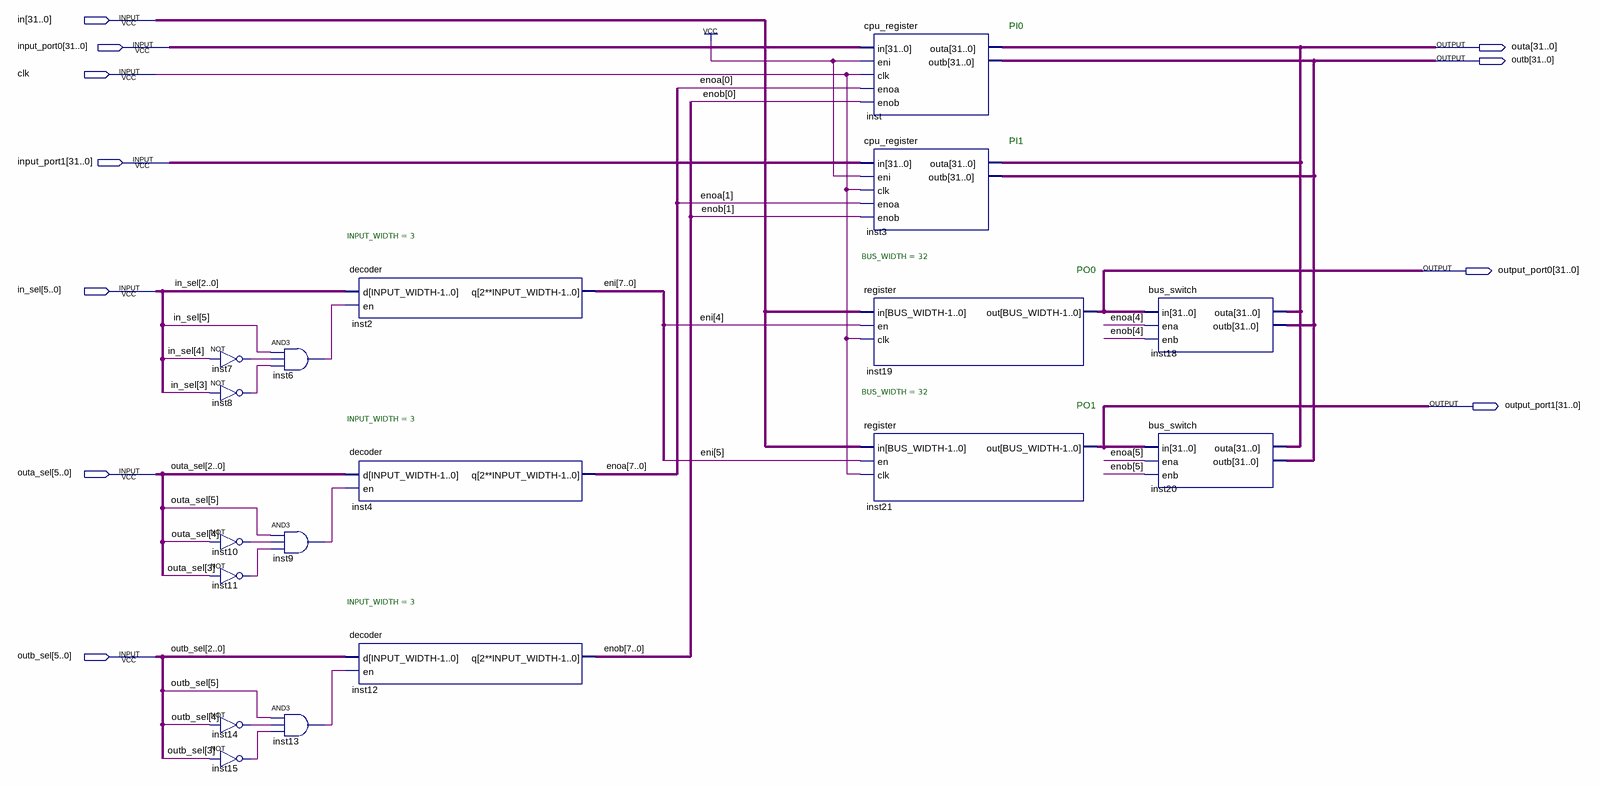
[diagram p0: schematic sheet]
// Quartus schematic port_register_bank.bdf as structural Verilog: 18 symbols, 11 pins
module port_register_bank (
  input  [31:0] in,
  input  [31:0] input_port0,
  input  clk,
  input  [31:0] input_port1,
  input  [5:0] in_sel,
  input  [5:0] outa_sel,
  input  [5:0] outb_sel,
  output [31:0] outa,
  output [31:0] outb,
  output [31:0] output_port0,
  output [31:0] output_port1
);

  wire inst6_out, inst7_out, inst8_out, inst9_out, inst10_out, inst11_out, inst13_out, inst14_out, inst15_out;
  wire [7:0] eni, enoa, enob;

  not inst7 (inst7_out, in_sel[4]);
  not inst8 (inst8_out, in_sel[3]);
  not inst10 (inst10_out, outa_sel[4]);
  not inst11 (inst11_out, outa_sel[3]);
  not inst14 (inst14_out, outb_sel[4]);
  not inst15 (inst15_out, outb_sel[3]);
  and inst6 (inst6_out, in_sel[5], inst7_out, inst8_out);
  and inst9 (inst9_out, outa_sel[5], inst10_out, inst11_out);
  and inst13 (inst13_out, outb_sel[5], inst14_out, inst15_out);
  decoder #(.INPUT_WIDTH(3)) inst2 (.d(in_sel[2:0]), .en(inst6_out), .q(eni));
  decoder #(.INPUT_WIDTH(3)) inst4 (.d(outa_sel[2:0]), .en(inst9_out), .q(enoa));
  decoder #(.INPUT_WIDTH(3)) inst12 (.d(outb_sel[2:0]), .en(inst13_out), .q(enob));
  cpu_register inst (.in(input_port0), .eni(1'b1), .clk(clk), .enoa(enoa[0]), .enob(enob[0]), .outa(outa), .outb(outb));
  cpu_register inst3 (
    .in(input_port1), .eni(1'b1), .clk(clk), .enoa(enoa[1]), .enob(enob[1]), .outa(outa), .outb(outb));
  register #(.BUS_WIDTH(32)) inst19 (.in(in), .en(eni[4]), .clk(clk), .out(output_port0));
  register #(.BUS_WIDTH(32)) inst21 (.in(in), .en(eni[5]), .clk(clk), .out(output_port1));
  bus_switch inst18 (.in(output_port0), .ena(enoa[4]), .enb(enob[4]), .outa(outa), .outb(outb));
  bus_switch inst20 (.in(output_port1), .ena(enoa[5]), .enb(enob[5]), .outa(outa), .outb(outb));

  // Notes on the sheet:
  //   PI0
  //   PI1
  //   PO0
  //   PO1
endmodule
